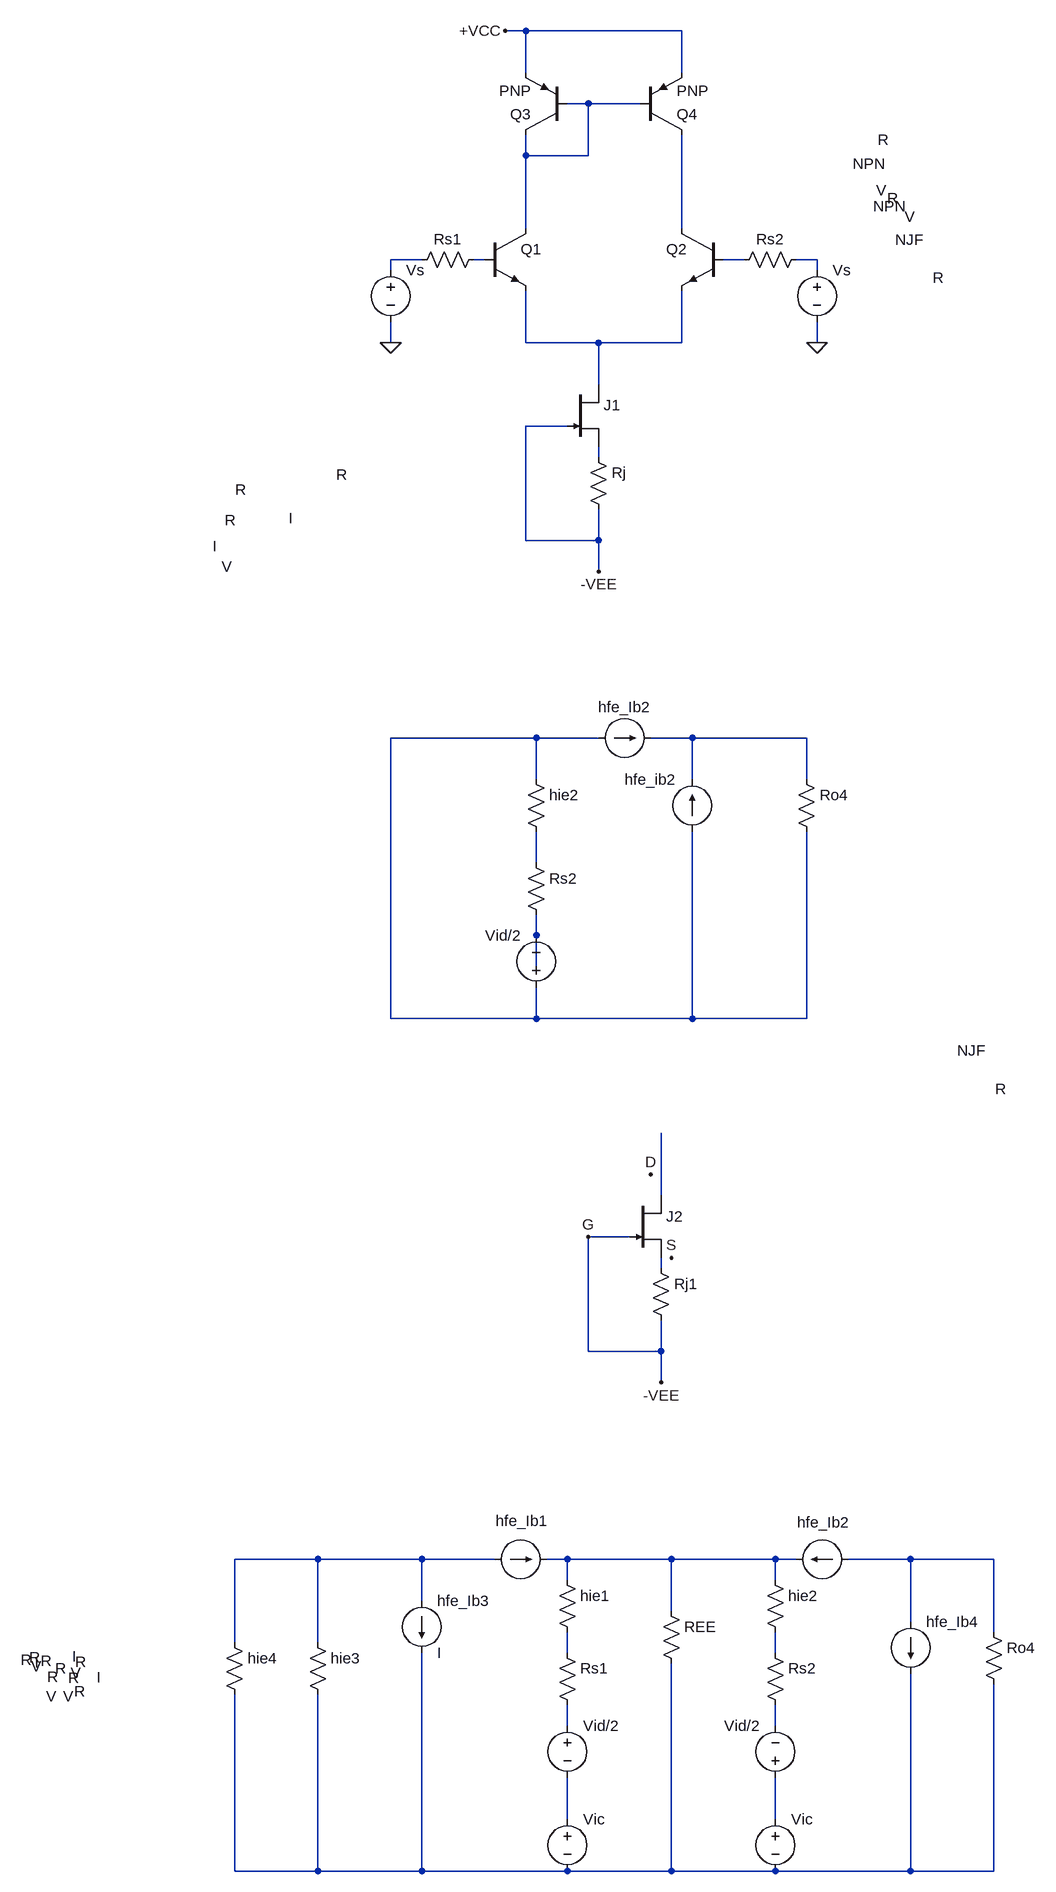
[diagram p0: schematic dibujos_segunda_tanda.asc]
dibujos_segunda_tanda.asc, the LTspice schematic file:
Version 4
SHEET 1 1992 3144
WIRE -496 -304 -528 -304
WIRE -256 -304 -496 -304
WIRE -496 -240 -496 -304
WIRE -256 -240 -256 -304
WIRE -400 -192 -432 -192
WIRE -320 -192 -400 -192
WIRE -496 -112 -496 -144
WIRE -400 -112 -400 -192
WIRE -400 -112 -496 -112
WIRE -496 0 -496 -112
WIRE -256 0 -256 -144
WIRE -656 48 -704 48
WIRE -560 48 -576 48
WIRE -160 48 -192 48
WIRE -48 48 -80 48
WIRE -704 64 -704 48
WIRE -48 64 -48 48
WIRE -704 176 -704 144
WIRE -496 176 -496 96
WIRE -384 176 -496 176
WIRE -256 176 -256 96
WIRE -256 176 -384 176
WIRE -48 176 -48 144
WIRE -384 240 -384 176
WIRE -432 304 -496 304
WIRE -384 352 -384 336
WIRE -496 480 -496 304
WIRE -384 480 -384 432
WIRE -384 480 -496 480
WIRE -384 528 -384 480
WIRE -480 784 -704 784
WIRE -384 784 -480 784
WIRE -240 784 -304 784
WIRE -64 784 -240 784
WIRE -480 848 -480 784
WIRE -240 848 -240 784
WIRE -64 848 -64 784
WIRE -480 976 -480 928
WIRE -480 1088 -480 1056
WIRE -480 1136 -480 1088
WIRE -704 1216 -704 784
WIRE -480 1216 -480 1168
WIRE -480 1216 -704 1216
WIRE -240 1216 -240 928
WIRE -240 1216 -480 1216
WIRE -64 1216 -64 928
WIRE -64 1216 -240 1216
WIRE -288 1488 -288 1392
WIRE -336 1552 -400 1552
WIRE -288 1600 -288 1584
WIRE -400 1728 -400 1552
WIRE -288 1728 -288 1680
WIRE -288 1728 -400 1728
WIRE -288 1776 -288 1728
WIRE -816 2048 -944 2048
WIRE -656 2048 -816 2048
WIRE -544 2048 -656 2048
WIRE -432 2048 -464 2048
WIRE -272 2048 -432 2048
WIRE -112 2048 -272 2048
WIRE -80 2048 -112 2048
WIRE 96 2048 0 2048
WIRE 224 2048 96 2048
WIRE -432 2080 -432 2048
WIRE -112 2080 -112 2048
WIRE -656 2112 -656 2048
WIRE -272 2128 -272 2048
WIRE 96 2144 96 2048
WIRE 224 2160 224 2048
WIRE -944 2176 -944 2048
WIRE -816 2176 -816 2048
WIRE -432 2192 -432 2160
WIRE -112 2192 -112 2160
WIRE -432 2304 -432 2272
WIRE -112 2304 -112 2272
WIRE -432 2448 -432 2384
WIRE -112 2448 -112 2384
WIRE -944 2528 -944 2256
WIRE -816 2528 -816 2256
WIRE -816 2528 -944 2528
WIRE -656 2528 -656 2192
WIRE -656 2528 -816 2528
WIRE -432 2528 -656 2528
WIRE -272 2528 -272 2208
WIRE -272 2528 -432 2528
WIRE -112 2528 -272 2528
WIRE 96 2528 96 2224
WIRE 96 2528 -112 2528
WIRE 224 2528 224 2240
WIRE 224 2528 96 2528
FLAG -704 176 0
FLAG -48 176 0
FLAG -384 528 -VEE
FLAG -528 -304 +VCC
FLAG -288 1776 -VEE
FLAG -304 1456 D
FLAG -400 1552 G
FLAG -272 1584 S
SYMBOL npn -560 0 R0
WINDOW 3 567 -100 Left 2
SYMATTR InstName Q1
SYMBOL npn -192 0 M0
WINDOW 3 -281 -34 Left 2
SYMATTR InstName Q2
SYMBOL res -560 32 R90
WINDOW 0 0 56 VBottom 2
WINDOW 3 -94 -629 VTop 2
SYMATTR InstName Rs1
SYMBOL res -64 32 R90
WINDOW 0 0 56 VBottom 2
WINDOW 3 -184 -118 VTop 2
SYMATTR InstName Rs2
SYMBOL voltage -48 48 R0
WINDOW 3 135 -66 Left 2
SYMATTR InstName Vs
SYMBOL voltage -704 48 R0
WINDOW 3 747 -107 Left 2
SYMATTR InstName Vs
SYMBOL current -544 2048 R270
WINDOW 0 44 42 VTop 2
WINDOW 3 -143 -704 VBottom 2
SYMATTR InstName hfe_Ib1
SYMBOL current 0 2048 R90
WINDOW 0 -41 38 VBottom 2
WINDOW 3 166 1153 VTop 2
SYMATTR InstName hfe_Ib2
SYMBOL res -448 2064 R0
WINDOW 3 -752 166 Left 2
SYMATTR InstName hie1
SYMBOL res -448 2176 R0
WINDOW 3 -794 28 Left 2
SYMATTR InstName Rs1
SYMBOL res -288 2112 R0
WINDOW 3 -901 94 Left 2
SYMATTR InstName REE
SYMBOL res -128 2064 R0
WINDOW 3 -1063 187 Left 2
SYMATTR InstName hie2
SYMBOL res -128 2176 R0
WINDOW 3 -1092 40 Left 2
SYMATTR InstName Rs2
SYMBOL voltage -432 2288 R0
WINDOW 3 -764 -65 Left 2
SYMATTR InstName Vid/2
SYMBOL voltage -112 2400 R180
WINDOW 0 24 96 Left 2
WINDOW 3 1129 187 Left 2
SYMATTR InstName Vid/2
SYMBOL voltage -432 2432 R0
WINDOW 3 -802 -173 Left 2
SYMATTR InstName Vic
SYMBOL voltage -112 2432 R0
WINDOW 3 -1096 -173 Left 2
SYMATTR InstName Vic
SYMBOL pnp -432 -144 R180
SYMATTR InstName Q3
SYMBOL pnp -320 -144 M180
SYMATTR InstName Q4
SYMBOL njf -432 240 R0
WINDOW 3 504 -223 Left 2
SYMATTR InstName J1
SYMBOL res -400 336 R0
WINDOW 3 530 -260 Left 2
SYMATTR InstName Rj
SYMBOL njf -336 1488 R0
WINDOW 3 504 -223 Left 2
SYMATTR InstName J2
SYMBOL res -304 1584 R0
WINDOW 3 530 -260 Left 2
SYMATTR InstName Rj1
SYMBOL res -496 832 R0
WINDOW 3 -447 -430 Left 2
SYMATTR InstName hie2
SYMBOL res -80 832 R0
WINDOW 3 -708 -453 Left 2
SYMATTR InstName Ro4
SYMBOL current -384 784 R270
WINDOW 0 32 40 VTop 2
WINDOW 3 311 -590 VBottom 2
SYMATTR InstName hfe_Ib2
SYMBOL voltage -480 1184 R180
WINDOW 0 24 96 Left 2
WINDOW 3 468 664 Left 2
SYMATTR InstName Vid/2
SYMBOL current -240 928 R180
WINDOW 0 24 80 Left 2
WINDOW 3 614 482 Left 2
SYMATTR InstName hfe_ib2
SYMBOL res -496 960 R0
WINDOW 3 -463 -511 Left 2
SYMATTR InstName Rs2
SYMBOL res -832 2160 R0
WINDOW 3 -428 39 Left 2
SYMATTR InstName hie3
SYMBOL res -960 2160 R0
WINDOW 3 -313 43 Left 2
SYMATTR InstName hie4
SYMBOL res 208 2144 R0
WINDOW 3 -1440 85 Left 2
SYMATTR InstName Ro4
SYMBOL current 96 2144 R0
WINDOW 3 -1290 53 Left 2
SYMATTR InstName hfe_Ib4
SYMBOL current -656 2112 R0
SYMATTR InstName hfe_Ib3

The netlist it stands for:
* dibujos_segunda_tanda.asc
Q1 N001 N004 N007 0 NPN
Q2 N002 N005 N007 0 NPN
Rs1 N004 N003 R
Rs2 N006 N005 R
Vs N006 0 V
Vs N003 0 V
I§hfe_Ib1 N015 N016 I
I§hfe_Ib2 N017 N016 I
R§hie1 N016 N018 R
Rs1 N018 N020 R
REE N016 N024 R
R§hie2 N016 N019 R
Rs2 N019 N021 R
Vid/2 N020 N022 V
Vid/2 N023 N021 V
Vic N022 N024 V
Vic N023 N024 V
Q3 N001 N001 +VCC 0 PNP
Q4 N002 N001 +VCC 0 PNP
J1 N007 G N008 NJF
Rj N008 G R
J2 N013 G N014 NJF
Rj1 N014 G R
R§hie2 N009 N011 R
Ro4 N010 N009 R
I§hfe_Ib2 N009 N010 I
Vid/2 N009 N012 V
I§hfe_ib2 N009 N010 I
Rs2 N011 N012 R
R§hie3 N015 N024 R
R§hie4 N015 N024 R
Ro4 N017 N024 R
I§hfe_Ib4 N017 N024 I
I§hfe_Ib3 N015 N024 I
.model NPN NPN
.model PNP PNP
.lib standard.bjt
.model NJF NJF
.model PJF PJF
.lib standard.jft
.backanno
.end